# EAGLE design OGX360I-2CH (EAGLE 9.6.2)
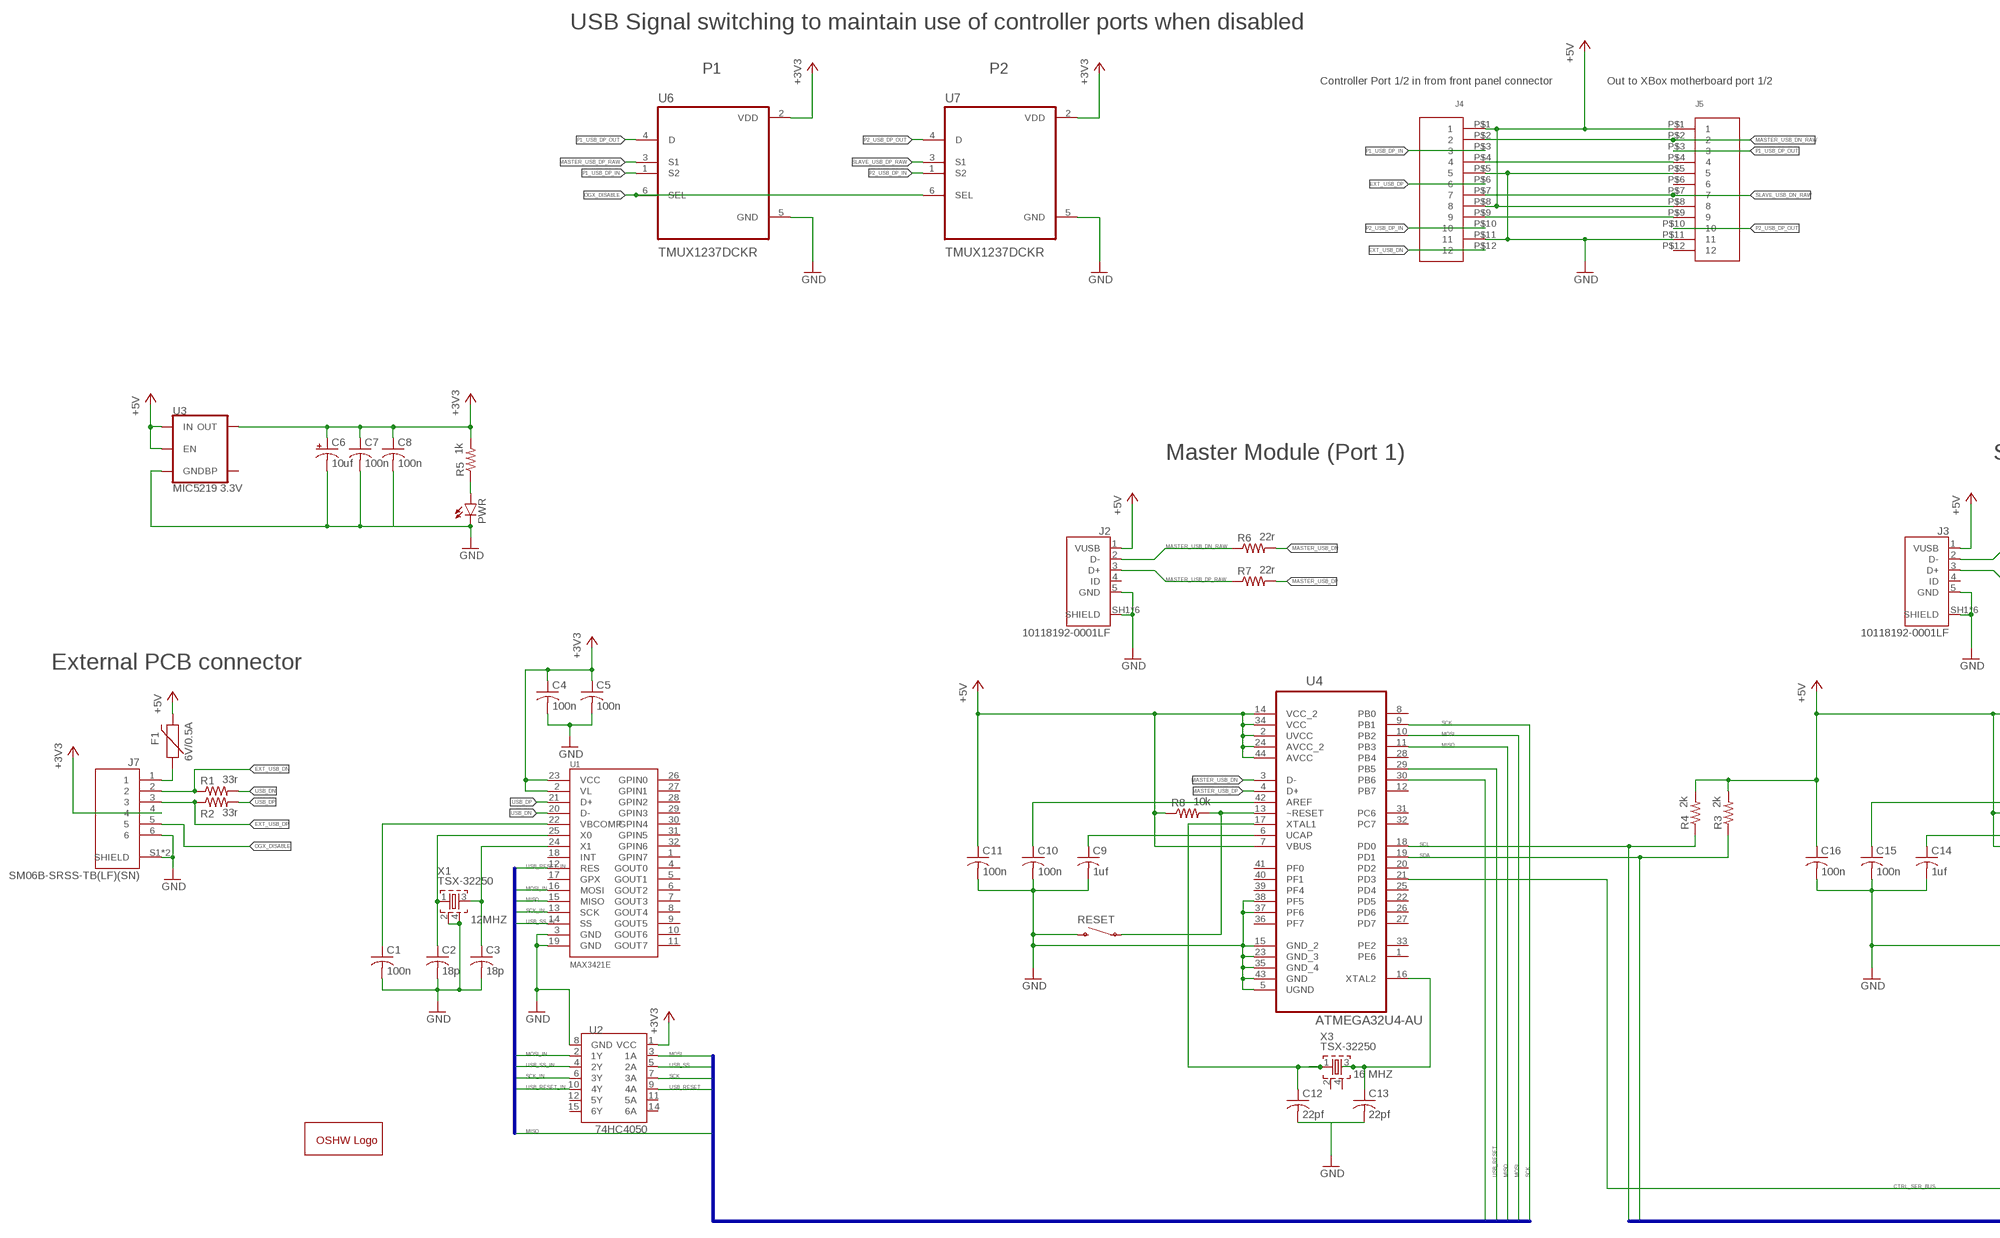
[diagram p0: schematic, sheet 1, part 1 of 2]
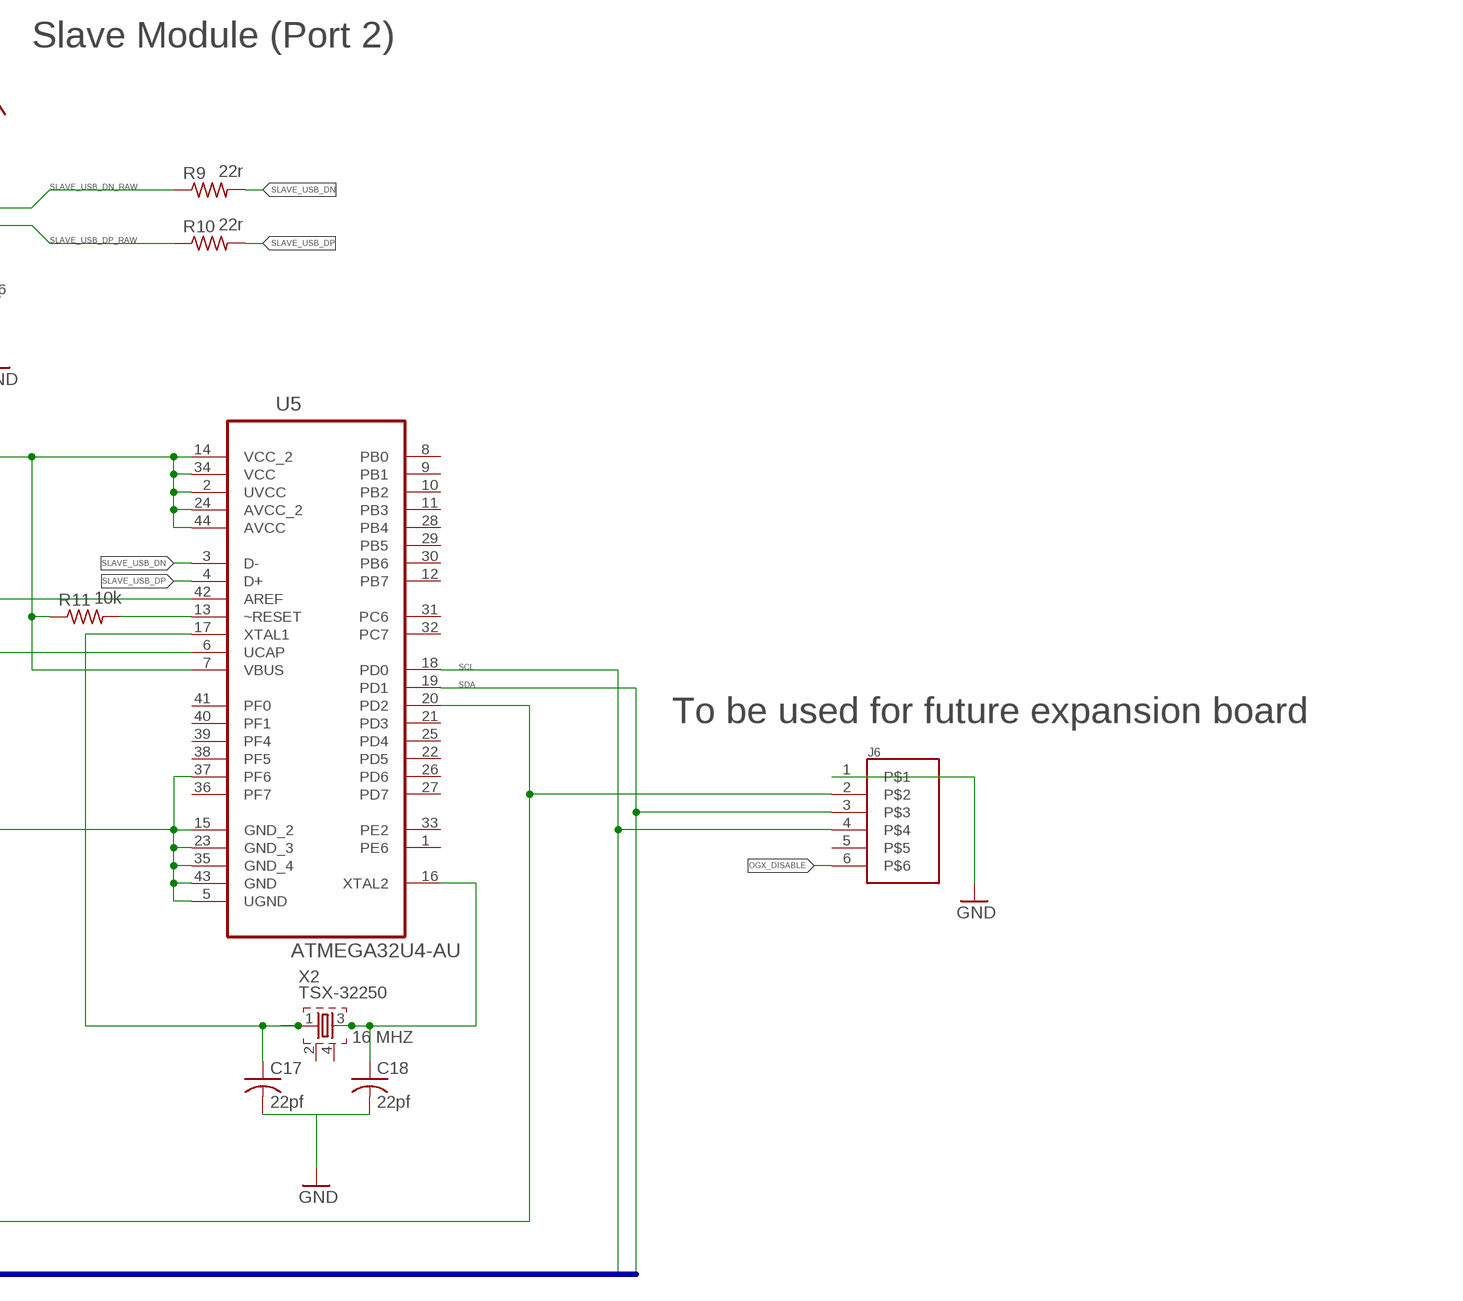
[diagram p1: schematic, sheet 1, part 2 of 2]

## Parts
C1  100n  C-USC0805  [C0805]
C2  18p  C-USC0805  [C0805]
C3  18p  C-USC0805  [C0805]
C4  100n  C-USC0805  [C0805]
C5  100n  C-USC0805  [C0805]
C6  10uf  CPOL-US153CLV-0405  [153CLV-0405]
C7  100n  C-USC0805  [C0805]
C8  100n  C-USC0805  [C0805]
C9  1uf  C-USC0805  [C0805]
C10  100n  C-USC0805  [C0805]
C11  100n  C-USC0805  [C0805]
C12  22pf  C-USC0805  [C0805]
C13  22pf  C-USC0805  [C0805]
C14  1uf  C-USC0805  [C0805]
C15  100n  C-USC0805  [C0805]
C16  100n  C-USC0805  [C0805]
C17  22pf  C-USC0805  [C0805]
C18  22pf  C-USC0805  [C0805]
F1  6V/0.5A  PPTC_HALF-AMP  [1206]
GOLD_ORB_SM1  OSHWLOGOLOGO8MM  [OSHW_8MM]
J2  10118192-0001LF  [AMPHENOL_10118192-0001LF]
J3  10118192-0001LF  [AMPHENOL_10118192-0001LF]
J4  B12B-PHDSS  [B12B-PHDSS]
J5  B12B-PHDSS  [B12B-PHDSS]
J6  B6B-PH-K-S  [B6B-PH-K]
J7  SM06B-SRSS-TB(LF)(SN)  [JST_SM06B-SRSS-TB(LF)(SN)]
PWR  LEDCHIP-LED0805  [CHIP-LED0805]
R1  33r  R-US_M0805  [M0805]
R2  33r  R-US_M0805  [M0805]
R3  2k  R-US_M0805  [M0805]
R4  2k  R-US_M0805  [M0805]
R5  1k  R-US_M0805  [M0805]
R6  22r  R-US_M0805  [M0805]
R7  22r  R-US_M0805  [M0805]
R8  10k  R-US_M0805  [M0805]
R9  22r  R-US_M0805  [M0805]
R10  22r  R-US_M0805  [M0805]
R11  10k  R-US_M0805  [M0805]
RESET  TL3305AF160QG  [TL3305AF160QG]
U1  MAX3421E  [TQFP32-5MM]
U2  74HC4050  HEX_CONVERTER  [SO16]
U3  MIC5219 3.3V  V_REG_MIC52193.3V  [SOT23-5]
U4  ATMEGA32U4-AU  [QFP80P1200X1200X120-44N]
U5  ATMEGA32U4-AU  [QFP80P1200X1200X120-44N]
U6  TMUX1237DCKR  [SOT65P210X110-6N]
U7  TMUX1237DCKR  [SOT65P210X110-6N]
X1  TSX-32250  [TSX-3225]
X2  TSX-32250  [TSX-3225]
X3  TSX-32250  [TSX-3225]

## Nets
+3V3: C4.1 C5.1 C6.+ C7.1 C8.1 J7.4 R5.2 U1.2(VL) U1.23(VCC) U2.1(VCC) U3.5(OUT) U6.2(VDD) U7.2(VDD)
+5V: C11.1 C16.1 F1.2 J2.1(VUSB) J3.1(VUSB) J4.P$1 J4.P$8 J5.P$1 J5.P$8 R3.2 R4.2 R8.1 R11.1 U3.1(IN) U3.3(EN) U4.2(UVCC) U4.7(VBUS) U4.14(VCC_2) U4.24(AVCC_2) U4.34(VCC) U4.44(AVCC) U5.2(UVCC) U5.7(VBUS) U5.14(VCC_2) U5.24(AVCC_2) U5.34(VCC) U5.44(AVCC)
CTRL_SER_BUS: J6.2 U4.21(PD3) U5.20(PD2)
EXT_USB_DN: J4.P$12 J7.2 R1.1
EXT_USB_DP: J4.P$6 J7.3 R2.1
GND: C1.2 C2.2 C3.2 C4.2 C5.2 C6.- C7.2 C8.2 C9.2 C10.2 C11.2 C12.2 C13.2 C14.2 C15.2 C16.2 C17.2 C18.2 J2.5(GND) J2.SH1(SHIELD) J2.SH2(SHIELD) J2.SH3(SHIELD) J2.SH4(SHIELD) J2.SH5(SHIELD) J2.SH6(SHIELD) J3.5(GND) J3.SH1(SHIELD) J3.SH2(SHIELD) J3.SH3(SHIELD) J3.SH4(SHIELD) J3.SH5(SHIELD) J3.SH6(SHIELD) J4.P$5 J4.P$11 J5.P$5 J5.P$11 J6.1 J7.6 J7.S1(SHIELD) J7.S2(SHIELD) PWR.C RESET.P$1 RESET.P$2 U1.3(GND) U1.19(GND) U2.8(GND) U3.2(GND) U4.5(UGND) U4.15(GND_2) U4.23(GND_3) U4.35(GND_4) U4.37(PF6) U4.38(PF5) U4.43(GND) U5.5(UGND) U5.15(GND_2) U5.23(GND_3) U5.35(GND_4) U5.37(PF6) U5.43(GND) U6.5(GND) U7.5(GND) X1.2 X1.4
MASTER_USB_DN: R6.2 U4.3(D-)
MASTER_USB_DN_RAW: J2.2(D-) J4.P$2 J5.P$2 R6.1
MASTER_USB_DP: R7.2 U4.4(D+)
MASTER_USB_DP_RAW: J2.3(D+) R7.1 U6.3(S1)
MISO: U1.15(MISO) U4.11(PB3)
MOSI: U2.3(1A) U4.10(PB2)
MOSI_IN: U1.16(MOSI) U2.2(1Y)
N$1: C13.1 U4.16(XTAL2) X3.3
N$2: C3.1 U1.24(X1) X1.3
N$3: F1.1 J7.1
N$4: PWR.A R5.1
N$5: C2.1 U1.25(X0) X1.1
N$6: C1.1 U1.22(VBCOMP)
N$10: C9.1 U4.6(UCAP)
N$11: C10.1 U4.42(AREF)
N$14: C12.1 U4.17(XTAL1) X3.1
N$15: C14.1 U5.6(UCAP)
N$16: C15.1 U5.42(AREF)
N$20: C18.1 U5.16(XTAL2) X2.3
N$21: C17.1 U5.17(XTAL1) X2.1
N$23: J4.P$4 J5.P$4
N$27: J4.P$9 J5.P$9
OGX_DISABLE: J6.6 J7.5 U6.6(SEL) U7.6(SEL)
P1_USB_DP_IN: J4.P$3 U6.1(S2)
P1_USB_DP_OUT: J5.P$3 U6.4(D)
P2_USB_DP_IN: J4.P$10 U7.1(S2)
P2_USB_DP_OUT: J5.P$10 U7.4(D)
RESET: R8.2 R11.2 RESET.P$3 RESET.P$4 U4.13(~RESET) U5.13(~RESET)
SCK: U2.7(3A) U4.9(PB1)
SCK_IN: U1.13(SCK) U2.6(3Y)
SCL: J6.4 R4.1 U4.18(PD0) U5.18(PD0)
SDA: J6.3 R3.1 U4.19(PD1) U5.19(PD1)
SLAVE_USB_DN: R9.2 U5.3(D-)
SLAVE_USB_DN_RAW: J3.2(D-) J4.P$7 J5.P$7 R9.1
SLAVE_USB_DP: R10.2 U5.4(D+)
SLAVE_USB_DP_RAW: J3.3(D+) R10.1 U7.3(S1)
USB_DN: R1.2 U1.20(D-)
USB_DP: R2.2 U1.21(D+)
USB_RESET: U2.9(4A) U4.29(PB5)
USB_RESET_IN: U1.12(RES) U2.10(4Y)
USB_SS: U2.5(2A) U4.30(PB6)
USB_SS_IN: U1.14(SS) U2.4(2Y)
Unconnected: J2.4(ID) J3.4(ID) J5.P$6 J5.P$12 J6.5 U1.1(GPIN7) U1.4(GOUT0) U1.5(GOUT1) U1.6(GOUT2) U1.7(GOUT3) U1.8(GOUT4) U1.9(GOUT5) U1.10(GOUT6) U1.11(GOUT7) U1.17(GPX) U1.18(INT) U1.26(GPIN0) U1.27(GPIN1) U1.28(GPIN2) U1.29(GPIN3) U1.30(GPIN4) U1.31(GPIN5) U1.32(GPIN6) U2.11(5A) U2.12(5Y) U2.14(6A) U2.15(6Y) U3.4(BP) U4.1(PE6) U4.8(PB0) U4.12(PB7) U4.20(PD2) U4.22(PD5) U4.25(PD4) U4.26(PD6) U4.27(PD7) U4.28(PB4) U4.31(PC6) U4.32(PC7) U4.33(PE2) U4.36(PF7) U4.39(PF4) U4.40(PF1) U4.41(PF0) U5.1(PE6) U5.8(PB0) U5.9(PB1) U5.10(PB2) U5.11(PB3) U5.12(PB7) U5.21(PD3) U5.22(PD5) U5.25(PD4) U5.26(PD6) U5.27(PD7) U5.28(PB4) U5.29(PB5) U5.30(PB6) U5.31(PC6) U5.32(PC7) U5.33(PE2) U5.36(PF7) U5.38(PF5) U5.39(PF4) U5.40(PF1) U5.41(PF0) X2.2 X2.4 X3.2 X3.4

## Buses
SPI_BUS_3.3V:MISO,MOSI_IN,SCK_IN,USB_RESET_IN,USB_SS_IN
SPI_BUS_5V:MISO,MOSI,SCK,USB_RESET,USB_SS
I2C:SCL,SDA

## Notes on the sheet
- USB Signal switching to maintain use of controller ports when disabled
- P1 | P2
- Controller Port 1/2 in from front panel connector | Out to XBox motherboard port 1/2
- Master Module (Port 1) | Slave Module (Port 2)
- External PCB connector
- To be used for future expansion board
- 12MHZ
- 16 MHZ | 16 MHZ

## Library data of the parts
C1-C5 C7-C18 = rcl:C-US: CAPACITOR, American symbol; SPICEPREFIX: C
C6 = rcl:CPOL-US: POLARIZED CAPACITOR, American symbol; SPICEPREFIX: C
F1 = SparkFun-Fuses:PPTC: Resettable Fuse PPTC Resettable Fuse. Really a sort of resistor with a polymeric positive temperature coefficient whose resistance increases dramatically with an increase in temperature. When heated by the power passing through the resistance rises causing the current to be limited, protecting the circuit. This is achieved by the transition of the polymer from a crystalline to an amorphous state where the conductive carbon separates breaking the conductive pathways found in the cool crystalline structure. When a PPTC cools back down it resumes conducting letting the circuit turn back on. SparkFun Products: SparkFun RedBoard - Programmed with Arduino <https://www.sparkfun.com/products/12757> Pro Micro - 5V/16MHz <https://www.sparkfun.com/products/12640> Arduino Pro 328 - 5V/16MHz <https://www.sparkfun.com/products/10915> MP3 Trigger <https://www.sparkfun.com/products/13720>; PROD_ID: RES-08585
GOLD_ORB_SM1 = oshw:OSHWLOGO: The OSHW logo for PCB layout
J2 J3 = 10118192-0001LF:10118192-0001LF: Single Port 5 Contact Horizontal Right Angle Shielded Micro B USB 2.0 Connector Check prices <https://snapeda.com/parts/10118192-0001LF/Amphenol%20ICC%20%28FCI%29/view-part/?ref=eda>; ARROW_ELECTRONICS-PURCHASE-URL: https://snapeda.com/shop?store=Arrow+Electronics&id=4793801; AVAILABILITY: Good; DESCRIPTION: USB - micro B USB 2.0 Receptacle Connector 5 Position Surface Mount, Right Angle; DIGIKEY-PURCHASE-URL: https://snapeda.com/shop?store=DigiKey&id=4793801; MF: Amphenol ICC (FCI); MOUSER-PURCHASE-URL: https://snapeda.com/shop?store=Mouser&id=4793801; MP: 10118192-0001LF; PACKAGE: None; PRICE: None
J4 J5 = B12B-PHDSS:B12B-PHDSS
J6 = B6B-PH-K-S:B6B-PH-K-S
J7 = SM06B-SRSS-TB_LF__SN_:SM06B-SRSS-TB(LF)(SN): SH Series 6 Position 1 mm Surface Mount Right Angle Side Entry Shrouded Header; DESCRIPTION: Connector Header Surface Mount, Right Angle 6 position 0.039 _1.00mm_; DIGI-KEY_PART_NUMBER: 455-1806-1-ND; DIGI-KEY_PURCHASE_URL: https://www.digikey.com/product-detail/en/jst-sales-america-inc/SM06B-SRSS-TB_LF__SN_/455-1806-1-ND/926877?utm_source=snapeda&utm_medium=aggregator&utm_campaign=symbol; MF: JST Sales; MP: SM06B-SRSS-TB_LF__SN_; PACKAGE: None
PWR = led:LED: LED OSRAM: - CHIPLED LG R971, LG N971, LY N971, LG Q971, LY Q971, LO R971, LY R971 LH N974, LH R974 LS Q976, LO Q976, LY Q976 LO Q996 - Hyper CHIPLED LW Q18S LB Q993, LB Q99A, LB R99A - SideLED LS A670, LO A670, LY A670, LG A670, LP A670 LB A673, LV A673, LT A673, LW A673 LH A674 LY A675 LS A676, LA A676, LO A676, LY A676, LW A676 LS A679, LY A679, LG A679 - Hyper Micro SIDELED® LS Y876, LA Y876, LO Y876, LY Y876 LT Y87S - SmartLED LW L88C, LW L88S LB L89C, LB L89S, LG L890 LS L89K, LO L89K, LY L89K LS L896, LA L896, LO L896, LY L896 - TOPLED LS T670, LO T670, LY T670, LG T670, LP T670 LSG T670, LSP T670, LSY T670, LOP T670, LYG T670 LG T671, LOG T671, LSG T671 LB T673, LV T673, LT T673, LW T673 LH T674 LS T676, LA T676, LO T676, LY T676, LB T676, LH T676, LSB T676, LW T676 LB T67C, LV T67C, LT T67C, LS T67K, LO T67K, LY T67K, LW E67C LS E67B, LA E67B, LO E67B, LY E67B, LB E67C, LV E67C, LT E67C LW T67C LS T679, LY T679, LG T679 LS T770, LO T770, LY T770, LG T770, LP T770 LB T773, LV T773, LT T773, LW T773 LH T774 LS E675, LA E675, LY E675, LS T675 LS T776, LA T776, LO T776, LY T776, LB T776 LHGB T686 LT T68C, LB T68C - Hyper Mini TOPLED® LB M676 - Mini TOPLED Santana® LG M470 LS M47K, LO M47K, LY M47K Source: http://www.osram.convergy.de LUXEON: - LUMILED® LXK2-PW12-R00, LXK2-PW12-S00, LXK2-PW14-U00, LXK2-PW14-V00 LXK2-PM12-R00, LXK2-PM12-S00, LXK2-PM14-U00 LXK2-PE12-Q00, LXK2-PE12-R00, LXK2-PE12-S00, LXK2-PE14-T00, LXK2-PE14-U00 LXK2-PB12-K00, LXK2-PB12-L00, LXK2-PB12-M00, LXK2-PB14-N00, LXK2-PB14-P00, LXK2-PB14-Q00 LXK2-PR12-L00, LXK2-PR12-M00, LXK2-PR14-Q00, LXK2-PR14-R00 LXK2-PD12-Q00, LXK2-PD12-R00, LXK2-PD12-S00 LXK2-PH12-R00, LXK2-PH12-S00 LXK2-PL12-P00, LXK2-PL12-Q00, LXK2-PL12-R00 Source: www.luxeon.com KINGBRIGHT: KA-3528ASYC Source: www.kingbright.com
R1-R11 = rcl:R-US_: RESISTOR, American symbol; SPICEPREFIX: R
RESET = TL3305AF160QG:TL3305AF160QG
U1 = MAX3421E:MAX3421E: USB Peripheral/Host Controller with SPI Interface.; AVAILABILITY: Unavailable; DESCRIPTION: USB Controller USB 2.0 SPI Interface 32-TQFN _5x5_; MF: Maxim Integrated; MP: MAX3421E; PACKAGE: TQFP-32 Maxim Integrated; PRICE: None
U2 = 74HC4050:HEX_CONVERTER: 74HC4050 Hex Buffer 74HC4050 Hex Buffer Level Shifter SMD SO016 SparkFun Products CAN-BUS Shield <https://www.sparkfun.com/products/13262> (DEV-13262) SparkFun MP3 Player Shield <https://www.sparkfun.com/products/12660> (DEV-12660) SparkFun microSD Shield <https://www.sparkfun.com/products/12761> (DEV-12761) SparkFun USB Host Shield <https://www.sparkfun.com/products/9947> (DEV-09947); PROD_ID: IC-09604
U3 = MIC5219-3.3YM5-TR:V_REG_MIC5219: V_REG MIC5219 Standard 3.3V and 5V 500mA LDO voltage regulator in SOT-23 layout. Micrel part MIC5219. BP (by-pass) pin is used to lower output noise with 470pF cap, may be left open.; PROD_ID: VREG-09872
U4 U5 = ATMEGA32U4-AU:ATMEGA32U4-AU: 8-bit Microcontroller with ISP Flash and USB Controller; AVAILABILITY: Unavailable; DESCRIPTION: AVR AVR® ATmega Microcontroller IC 8-Bit 16MHz 32KB _16K x 16_ FLASH 44-TQFP _10x10_; MF: Microchip; MP: ATMEGA32U4-AU; PACKAGE: TQFP-44 Microchip; PRICE: None
U6 U7 = TMUX1237DCKR:TMUX1237DCKR: None Check prices <https://pricing.snapeda.com/search/part/TMUX1237DCKR/?ref=eda>; AVAILABILITY: Warning; DESCRIPTION: 3-? low ron, 5-V, 2:1 (SPDT) general purpose switch with no overshoot when switching inputs 6-SC70 -40 to 125; MF: Texas Instruments; MP: TMUX1237DCKR; PACKAGE: SOT-SC70-6 Texas Instruments; PRICE: None; PURCHASE-URL: https://pricing.snapeda.com/search/part/TMUX1237DCKR/?ref=eda
X1-X3 = TSX-3225:TSX-3225: MHz RANGE CRYSTAL UNIT Source: Epson Toyocom; DESCRIPTION: 26MHz ±10ppm Crystal 9pF 40 Ohms 4-SMD, No Lead; DIGI-KEY_PART_NUMBER: SER4180CT-ND; DIGI-KEY_PURCHASE_URL: https://www.digikey.com/product-detail/en/epson/TSX-3225-24.0000MF15X-AC6/SER4180CT-ND/6558821?utm_source=snapeda&utm_medium=aggregator&utm_campaign=symbol; MF: EPSON; MP: TSX-3225; PACKAGE: SMD-4 Epson

## Board
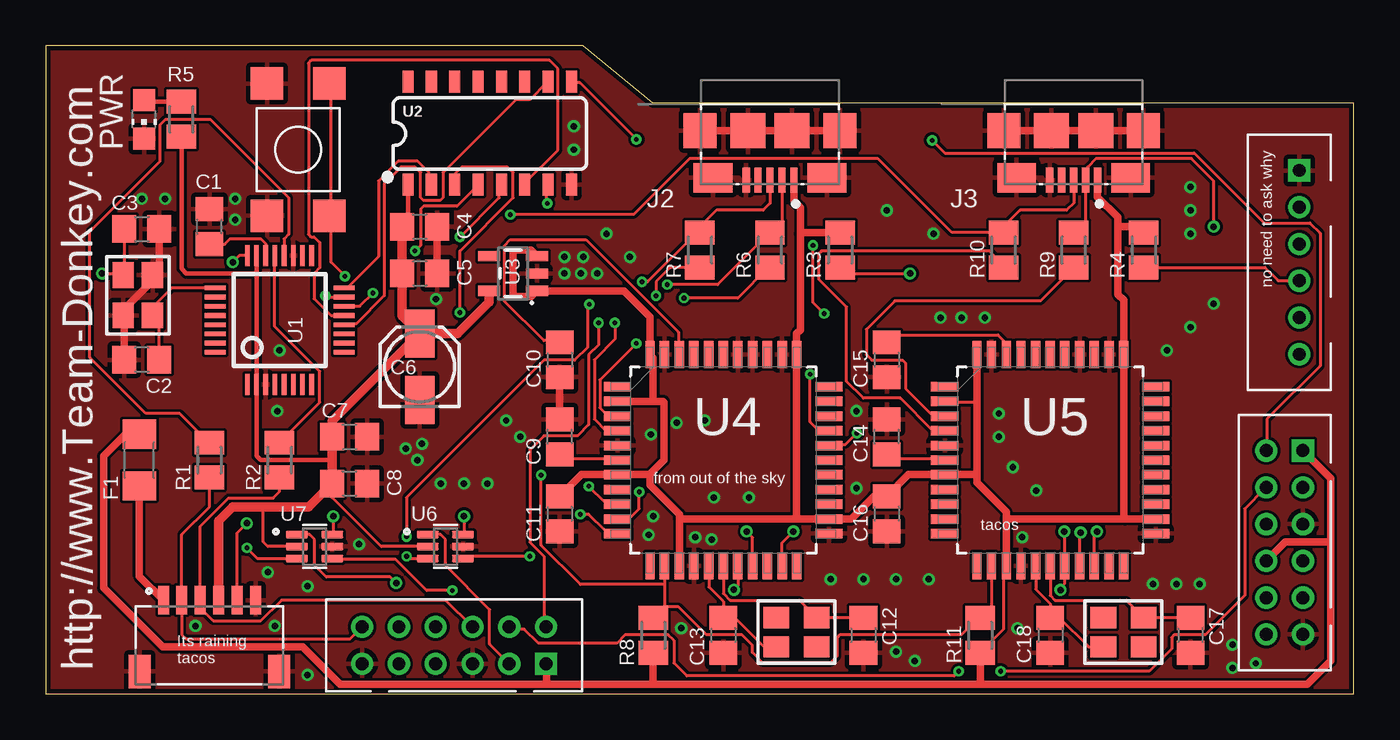
[diagram p2: board, top side]
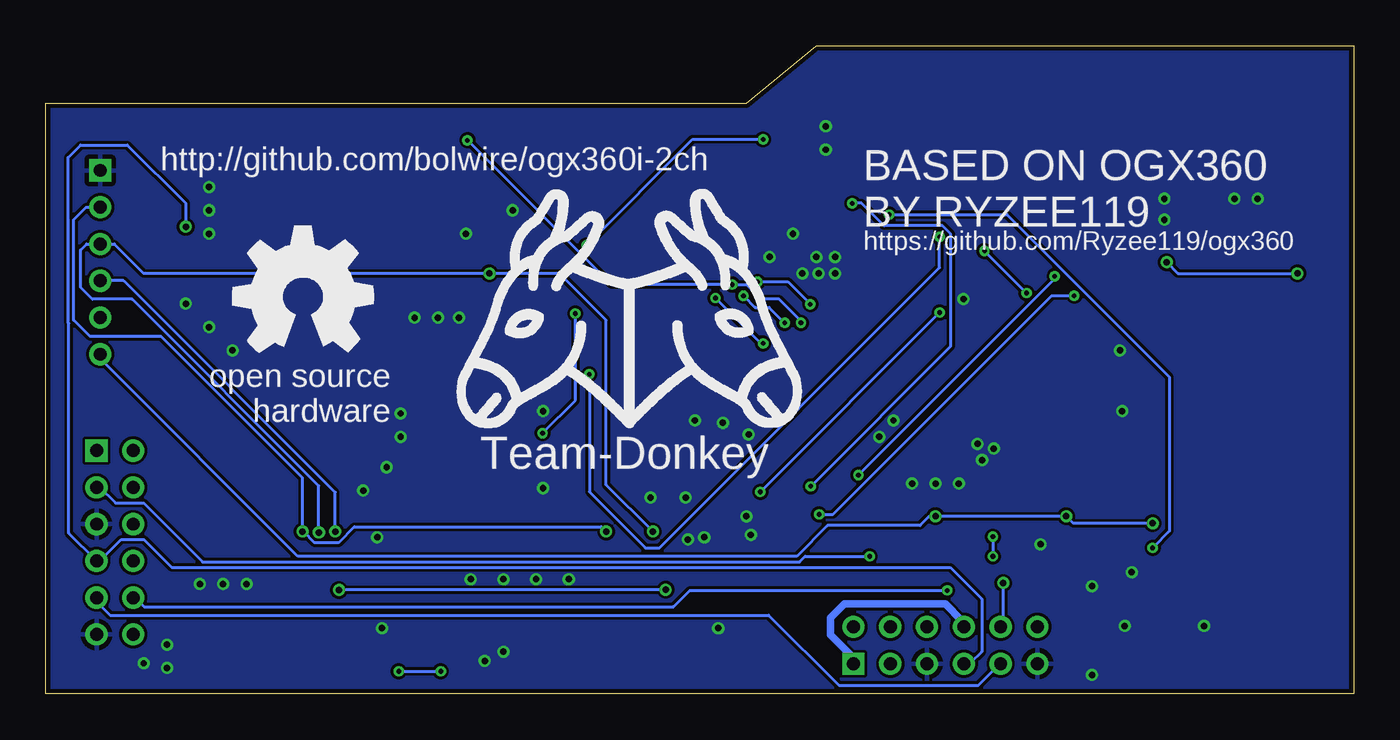
[diagram p3: board, bottom side, seen from below]

Size 71.1 x 35.23 mm. Coordinates in mm from the lower left corner, seen from the top.
Outline: 0,0 71.1,0 71.1,32.13 33.02,32.13 29.21,35.23 0,35.23 0,0
Copper layers (1*16): Top 0.035mm / dielectric 0.15mm / Bottom 0.035mm
Design rules "default *": minimum track width 6mil, minimum drill 10mil, track to track 6mil, track to pad 6mil, pad to pad 6mil, via to via 6mil, smd to smd 0mil, copper to edge 10mil, drill to drill 10mil, minimum pad ring 10mil, minimum via ring 6mil, stop-mask expansion 2mil, vias tented up to drill 100mil, thermal gap 10mil

### Footprints (pad centres in the part's own frame; a part is rotated, then mirrored left to right if it is on the bottom)
C0805 = smd 1.3 x 1.5: 1 -0.95,0; 2 0.95,0
153CLV-0405 = smd 2.6 x 1.6: + 1.8,0; - -1.8,0
1206 = smd 1.6 x 1.8: 1 -1.4,0; 2 1.4,0
AMPHENOL_10118192-0001LF = smd 0.4 x 1.35: 1 -1.3,0; 2 -0.65,0; 3 0,0; 4 0.65,0; 5 1.3,0 | smd 2.1 x 1.6: SH1 -3.1,-0.125; SH2 3.1,-0.125 | smd 1.8 x 1.9: SH3 -3.8,-2.675; SH6 3.8,-2.675 | smd 1.9 x 1.9: SH4 -1.2,-2.675; SH5 1.2,-2.675
B12B-PHDSS = drill 0.7 square: P$1 11.95,1.5 | drill 0.7: P$2 11.95,3.5; P$3 9.95,1.5; P$4 9.95,3.5; P$5 7.95,1.5; P$6 7.95,3.5; P$7 5.95,1.5; P$8 5.95,3.5; P$9 3.95,1.5; P$10 3.95,3.5; P$11 1.95,1.5; P$12 1.95,3.5
B6B-PH-K = drill 0.7 square: 1 11.95,1.7 | drill 0.7: 2 9.95,1.7; 3 7.95,1.7; 4 5.95,1.7; 5 3.95,1.7; 6 1.95,1.7
JST_SM06B-SRSS-TB(LF)(SN) = smd 0.6 x 1.55: 1 -2.5,0; 2 -1.5,0; 3 -0.5,0; 4 0.5,0; 5 1.5,0; 6 2.5,0 | smd 1.2 x 1.8: S1 -3.8,-3.875; S2 3.8,-3.875
CHIP-LED0805 = smd 1.2 x 1.2: A 0,-1.05; C 0,1.05
M0805 = smd 1.3 x 1.6: 1 -0.95,0; 2 0.95,0
TL3305AF160QG = smd 1.778 x 1.778: P$1 -3.6,-1.7; P$2 3.6,-1.7; P$3 -3.6,1.7 | smd 1.778 x 1.779: P$4 3.6,1.7
TQFP32-5MM = smd 1.143 x 0.254: 1 -3.5,1.75; 2 -3.5,1.25; 3 -3.5,0.75; 4 -3.5,0.25; 5 -3.5,-0.25; 6 -3.5,-0.75; 7 -3.5,-1.25; 8 -3.5,-1.75; 17 3.5,-1.75; 18 3.5,-1.25; 19 3.5,-0.75; 20 3.5,-0.25; 21 3.5,0.25; 22 3.5,0.75; 23 3.5,1.25; 24 3.5,1.75 | smd 0.254 x 1.143: 9 -1.75,-3.5; 10 -1.25,-3.5; 11 -0.75,-3.5; 12 -0.25,-3.5; 13 0.25,-3.5; 14 0.75,-3.5; 15 1.25,-3.5; 16 1.75,-3.5; 25 1.75,3.5; 26 1.25,3.5; 27 0.75,3.5; 28 0.25,3.5; 29 -0.25,3.5; 30 -0.75,3.5; 31 -1.25,3.5; 32 -1.75,3.5
SO16 = smd 0.6 x 1.2: 1 -4.445,-2.8; 2 -3.175,-2.8; 3 -1.905,-2.8; 4 -0.635,-2.8; 5 0.635,-2.8; 6 1.905,-2.8; 7 3.175,-2.8; 8 4.445,-2.8; 9 4.445,2.8; 10 3.175,2.8; 11 1.905,2.8; 12 0.635,2.8; 13 -0.635,2.8; 14 -1.905,2.8; 15 -3.175,2.8; 16 -4.445,2.8
SOT23-5 = smd 0.55 x 1.2: 1 -0.95,-1.3; 2 0,-1.3; 3 0.95,-1.3; 4 0.95,1.3; 5 -0.95,1.3
QFP80P1200X1200X120-44N = smd 1.473 x 0.508: 1 -5.74,3.988; 2 -5.74,3.2; 3 -5.74,2.388; 4 -5.74,1.6; 5 -5.74,0.787; 6 -5.74,0; 7 -5.74,-0.787; 8 -5.74,-1.6; 9 -5.74,-2.388; 10 -5.74,-3.2; 11 -5.74,-3.988; 23 5.74,-3.988; 24 5.74,-3.2; 25 5.74,-2.388; 26 5.74,-1.6; 27 5.74,-0.787; 28 5.74,0; 29 5.74,0.787; 30 5.74,1.6; 31 5.74,2.388; 32 5.74,3.2; 33 5.74,3.988 | smd 0.508 x 1.473: 12 -3.988,-5.74; 13 -3.2,-5.74; 14 -2.388,-5.74; 15 -1.6,-5.74; 16 -0.787,-5.74; 17 0,-5.74; 18 0.787,-5.74; 19 1.6,-5.74; 20 2.388,-5.74; 21 3.2,-5.74; 22 3.988,-5.74; 34 3.988,5.74; 35 3.2,5.74; 36 2.388,5.74; 37 1.6,5.74; 38 0.787,5.74; 39 0,5.74; 40 -0.787,5.74; 41 -1.6,5.74; 42 -2.388,5.74; 43 -3.2,5.74; 44 -3.988,5.74
SOT65P210X110-6N = smd 1.19 x 0.4: 1 -0.96,0.65; 2 -0.96,0; 3 -0.96,-0.65; 4 0.96,-0.65; 5 0.96,0; 6 0.96,0.65
TSX-3225 = smd 1.4 x 1.15: 1 0,-1.6; 2 2.2,-1.6; 3 2.2,0; 4 0,0

### Placement (x,y rotation side)
C1  8.89,25.4 90 top
C2  5.21,18.16 180 top
C3  5.21,25.27 0 top
C4  20.32,25.4 0 top
C5  20.32,22.86 0 top
C6  20.32,17.78 90 top
C7  16.51,13.97 0 top
C8  16.51,11.43 0 top
C9  27.94,13.97 90 top
C10  27.94,18.16 270 top
C11  27.94,9.78 270 top
C12  44.45,3.17 270 top
C13  36.83,3.17 270 top
C14  45.72,13.97 90 top
C15  45.72,18.16 270 top
C16  45.72,9.78 270 top
C17  62.23,3.17 270 top
C18  54.61,3.17 270 top
F1  5.08,12.7 90 top
GOLD_ORB_SM1  57.15,21.59 0 bottom
J2  39.37,27.94 180 top
J3  55.88,27.94 180 top
J4  15.24,0.13 0 top
J5  69.85,1.27 90 top
J6  69.85,16.51 90 top
J7  8.89,5.08 0 top
PWR  5.33,31.24 180 top
R1  8.89,12.7 90 top
R2  12.7,12.7 90 top
R3  43.18,24.13 90 top
R4  59.69,24.13 90 top
R5  7.37,31.24 270 top
R6  39.37,24.13 270 top
R7  35.56,24.13 270 top
R8  33.02,3.17 90 top
R9  55.88,24.13 270 top
R10  52.07,24.13 270 top
R11  50.8,3.17 90 top
RESET  13.72,29.59 270 top
U1  12.7,20.32 90 top
U2  24.13,30.48 0 top
U3  25.4,22.86 90 top
U4  36.83,12.7 0 top
U5  54.61,12.7 0 top
U6  21.72,8 0 top
U7  14.61,8 0 top
X1  4.19,20.57 90 top
X2  59.69,2.54 180 top
X3  41.91,2.54 180 top

### Tracks (layer width: path | path; a pad name or v marks a point on that pad's centre or on a via)
+3V3
  Top 0.152: U7.2 12.07,8 11.81,8.26 11.81,10.03 11.94,10.16 | U6.2 18.23,8 15.56,10.67 C8.1
  Top 0.254: U1.23 11.45,22.86 | 11.45,22.86 U1.2 11.45,12.93 11.68,12.7 15.56,12.7 | U2.1 19.68,25.71 C4.1 | R5.2 7.37,23.11 7.62,22.86 11.45,22.86
  Top 0.508: C4.1 C5.1 19.37,20.53 C6.+ | U3.5 24.1,21.31 22.37,19.58 C6.+ | C6.+ 15.56,14.82 C7.1 15.56,12.7 C8.1 14.29,10.16 11.94,10.16 10.16,10.16 9.39,9.39 J7.4
+5V
  Top 0.152: 27.23,1.52 J4.P$1 | 50.61,15.85 48.87,15.85 U5.2 | R11.1 50.8,2.24 52.07,3.5 52.07,6.86 U5.14
  Top 0.406: U3.3 26.38,24.13 25.4,24.13 25.4,21.59 26.38,21.59 U3.1 31.43,21.91 32.84,20.5 U4.44 33.02,18.26 33.02,15.9 | F1.2 4.32,14.1 3.14,12.92 3.14,5.75 6.35,2.54 13.97,2.54 16,0.51 27.23,0.51 | J5.P$1 69.85,11.72 69.85,8.26 | 27.23,0.51 33.02,0.51 | 33.02,0.51 50.8,0.51 | 50.8,0.51 68.58,0.51 69.85,1.78 69.85,8.26 | 50.8,0.51 R11.1 | R8.1 33.02,0.51 | 69.85,8.26 67.39,8.26 J5.P$8 | 34.44,9.53 34.44,9.75 32.84,11.35 32.84,11.94 | 34.44,9.53 U4.14 | 52.22,9.53 52.22,9.88 50.61,11.49 50.61,11.94 | 52.22,9.53 U5.14 | 40.77,9.5 U4.24 43.79,9.5 45.02,10.73 C16.1 46.9,11.91 U5.7 50.58,11.91 50.61,11.94 | 40.77,9.5 34.47,9.5 34.44,9.53 | U5.24 58.67,9.5 | 58.67,9.5 52.25,9.5 52.22,9.53 | 40.77,9.5 40.82,9.55 U4.34 40.82,19.58 41.02,19.79 41.02,25.02 | 58.67,9.5 58.6,9.58 U5.34 58.6,21.41 58.29,21.72 58.29,25.4 | 58.29,25.4 58.29,25.91 57.18,27.02 J3.1 | 58.29,25.4 59.37,25.4 | U5.44 50.61,18.43 50.61,15.85 50.61,11.94 | 32.84,11.94 32.82,11.91 U4.7 29.12,11.91 C11.1 | 32.84,11.94 33.6,12.7 33.6,15.85 33.55,15.9 33.02,15.9 | J2.1 40.67,26.8 41.02,26.45 41.02,25.02 | R3.2 41.08,25.08 41.02,25.02 | 27.23,0.51 27.23,1.52 | 33.02,15.9 U4.2
  Top 0.508: 59.37,25.4 R4.2
  Bottom 0.152: 21.29,3.66 J4.P$8 | 27.23,1.68 J4.P$1
  Bottom 0.406: 21.29,3.66 21.29,3.96 22.2,4.88 27.69,4.88 28.45,4.12 28.45,3.2 27.23,1.98 27.23,1.68
CTRL_SER_BUS  (via drill 0.35)
  Top 0.152: U5.20 57,8.66 v57.15,8.82 | U4.21 40.03,8.21 v40.64,8.82
  Bottom 0.152: J6.2 68.92,26.46 69.6,25.78 69.6,20.32 68.71,19.43 64.84,19.43 57.15,11.74 v57.15,8.82 57.1,8.82 56.49,8.21 55.2,8.21 54.33,9.07 40.89,9.07 v40.64,8.82
EXT_USB_DN
  Top 0.152: R1.1 8.89,10.16 7.39,8.66 J7.2 7.39,3.2 7.62,2.97 16.54,2.97 J4.P$12
EXT_USB_DP
  Top 0.152: R2.1 12.7,10.99 12.36,10.64 9.93,10.64 8.39,9.1 J7.3 8.48,5.03 8.48,4.57 9.09,3.96 11.68,3.96 12.8,5.08 21.74,5.08 J4.P$6
GND  (via drill 0.35)
  Top 0.406: J2.SH6 J2.SH5 J2.SH4 J2.SH3 | J3.SH6 J3.SH5 J3.SH4 J3.SH3 | C2.2 4.26,20.51 X1.4 4.19,20.88 5.79,22.48 X1.2 6.16,23.14 C3.2 | C5.2 C4.2 | C10.2 C9.2
  other vias: 8.13,3.68 12.45,3.68 14.22,1.02 17.02,8.13 20.19,12.7 19.56,13.34 20.45,13.59 21.46,11.43 22.73,11.43 24,11.43 25.02,14.86 25.78,13.97 33.02,9.65 32.77,8.64 35.31,8.51 36.2,8.38 34.54,3.56 46.23,2.29 47.24,1.78 53.09,8.51 52.83,3.56 64.52,1.4 64.52,2.67 65.79,1.65 60.2,5.97 61.47,5.97 62.74,5.97 53.85,11.05 52.58,12.32 51.82,13.97 51.82,15.24 44.07,11.18 44.07,15.37 35.81,14.86 34.29,14.73 36.32,10.67 38.23,10.67 32.89,14.1 28.19,23.75 28.19,22.86 29.08,22.86 29.97,22.86 29.21,23.75 28.7,30.86 28.7,29.59 30.48,25.02 31.75,23.75 45.72,26.29 48.26,25.02 62.23,27.56 62.23,26.29 62.23,25.02 42.67,6.22 44.45,6.22 46.23,6.22 48.01,6.22 10.29,26.92 10.29,25.78 6.48,26.92 5.21,26.92 12.7,18.67 12.57,15.37 21.21,21.46 12.07,6.6 14.22,5.84 63.5,21.21 62.23,19.94 60.96,18.67 48.64,20.45 49.78,20.45 51.05,20.45
  pour Bottom: -5.08,40.64 74.93,40.64 74.93,-10.16 -8.89,-10.16 -8.89,36.83
  pour Top: -5.08,38.1 -5.08,-3.81 -3.81,-5.08 72.39,-5.08 74.93,-2.54 74.93,34.29 71.12,38.1
MASTER_USB_DN  (via drill 0.25)
  Top 0.152: U4.3 30.58,15.09 30.12,15.54 30.12,17.07 v32.11,19.05 | v34.7,21.51 37.62,21.51 39.27,23.16 R6.2
  Bottom 0.152: v34.7,21.51 32.23,19.05 v32.11,19.05
MASTER_USB_DN_RAW  (via drill 0.25)
  Top 0.152: J2.2 40.02,25.73 R6.1 39.27,24.99 36.52,22.25 v33.78,22.25 | v30.05,20.17 30.05,18.97 29.52,18.44 29.52,14.63 28.9,14.02 27.08,14.02 26.31,13.26 26.31,8.23 27.08,7.47 27.08,3.66 J4.P$2 | v48.18,30.1 48.87,29.41 62.43,29.41 66.24,25.6 68.73,25.6 69.29,25.04 69.29,17.83 66.4,14.94 66.4,13.26 J5.P$2
  Bottom 0.152: v48.18,30.1 40.34,22.25 v33.78,22.25 33.02,22.25 32.24,21.48 31.25,21.48 30.05,20.27 v30.05,20.17
MASTER_USB_DP  (via drill 0.25)
  Top 0.152: v30.94,20.17 30.94,19.28 29.82,18.16 29.82,14.94 30.43,14.33 31.04,14.33 U4.4 | v33.17,21.64 33.17,22.4 33.93,23.16 35.46,23.16 R7.2
  Bottom 0.152: v33.17,21.64 32.54,21.01 31.77,21.01 v30.94,20.17
MASTER_USB_DP_RAW  (via drill 0.25)
  Top 0.152: J2.3 39.37,26.67 38.99,26.29 36.45,26.29 35.56,25.4 R7.1 35.46,25.15 32.72,22.4 v32.41,22.4 | v19.61,8.53 19.61,10.67 27.08,18.14 28.75,18.14 29.44,18.82 29.44,21.08 v29.54,21.18 | U6.3 19.65,7.35 19.61,7.41 v19.61,7.47
  Bottom 0.152: v19.61,8.53 v19.61,7.47 | v32.41,22.4 30.76,22.4 v29.54,21.18
MISO  (via drill 0.25)
  Top 0.152: v29.06,9.75 29.52,9.75 30.43,8.84 31.04,8.84 U4.11 | v15.19,21.64 15.26,21.57 U1.15
  Bottom 0.152: v15.19,21.64 16.41,21.64 28.3,9.75 v29.06,9.75
MOSI  (via drill 0.25)
  Top 0.152: U2.3 22.22,28.27 22.61,28.65 25.09,28.65 25.4,28.35 25.4,26.98 22.5,24.08 v22.5,20.73 | v32.26,10.97 32.26,10.06 31.8,9.6 31.19,9.6 U4.10
  Bottom 0.152: v32.26,10.97 v22.5,20.73
MOSI_IN
  Top 0.152: U1.16 16.26,22.1 16.41,22.1 18.09,23.77 18.09,27.89 19.15,28.96 20.22,28.96 20.83,28.35 20.83,27.74 U2.2
N$1
  Top 0.152: U4.16 36.04,5.8 36.83,5.01 C13.1 37.46,4.12 39.05,2.54 X3.3
N$2  (via drill 0.35)
  Top 0.152: C3.1 4.26,22.84 X1.3 4.11,22.86 v3.05,22.86 | U1.24 10.51,23.82 v10.16,23.47
  Bottom 0.152: v10.16,23.47 9.55,22.86 v3.05,22.86
N$3
  Top 0.406: J7.1 5.08,6.39 F1.1
N$4
  Top 0.254: PWR.A 5.43,32.19 R5.1
N$5
  Top 0.152: C2.1 6.16,20.21 X1.1 5.79,21.03 6.83,22.07 U1.25
N$6
  Top 0.152: C1.1 9.72,24.45 10.01,24.75 11.68,24.75 11.95,24.48 U1.22
N$10
  Top 0.152: U4.6 31.04,12.8 28.14,12.8 27.99,12.95 C9.1
N$11
  Top 0.152: U4.42 34.39,18.44 34.39,19.66 29.36,24.69 25.25,24.69 24.94,24.38 24.94,21.34 27.08,19.2 27.84,19.2 C10.1
N$14
  Top 0.152: C12.1 44.44,4.14 X3.1 40.97,5.08 37.2,5.08 36.83,5.45 U4.17
N$15
  Top 0.152: U5.6 48.87,12.8 45.97,12.8 45.82,12.95 C14.1
N$16
  Top 0.152: U5.42 52.22,19.05 51.77,19.51 46.13,19.51 45.82,19.2 C15.1
N$20
  Top 0.152: X2.3 56.7,2.54 55.12,4.12 C18.1 54.61,4.89 53.82,5.67 U5.16
N$21
  Top 0.152: C17.1 62.21,4.14 X2.1 58.75,5.08 58.42,5.08 54.86,5.08 54.61,5.33 U5.17
N$23  (via drill 0.25)
  Top 0.152: v51.92,1.22 59.99,1.22 61.21,2.44 61.21,3.05 61.37,3.2 63.04,3.2 65.18,5.33 65.18,10.06 66.24,11.12 J5.P$4 | J4.P$4 25.25,3.5 26.01,3.5 26.77,2.74 31.04,2.74 31.5,3.2 33.83,3.2 34.14,2.9 34.14,1.68 34.85,0.96 49.38,0.96 v49.63,1.22
  Bottom 0.152: v51.92,1.22 v49.63,1.22
N$27
  Bottom 0.152: J4.P$9 19.23,1.63 20.4,0.46 27.99,0.46 31.8,4.27 67.62,4.27 68.35,5 J5.P$9
OGX_DISABLE  (via drill 0.35)
  Top 0.152: J7.5 10.39,8.74 v10.92,9.27 | v15.62,9.65 15.62,8.71 U7.6 | v22.73,9.65 22.73,8.71 U6.6
  Bottom 0.152: v10.92,9.27 15.24,9.27 v15.62,9.65 v22.73,9.65 22.81,9.6 23.11,9.6 23.57,9.14 28.6,9.14 30.28,7.47 57.4,7.47 68.07,18.14 68.07,18.44 J6.6
P1_USB_DP_IN
  Top 0.152: J4.P$3 24.13,2.69 24.13,4.57 21.72,6.99 21.72,8.38 21.45,8.65 U6.1
P1_USB_DP_OUT  (via drill 0.25)
  Top 0.152: v26.31,7.47 22.81,7.47 U6.4
  Bottom 0.152: v26.31,7.47 29.82,7.47 30.12,7.16 62.59,7.16 65.79,10.36 67.31,10.36 68.22,11.28 J5.P$3
P2_USB_DP_IN  (via drill 0.35)
  Top 0.152: U7.1 14.34,8.65 14.61,8.38 14.61,6.99 15.24,6.35 18.72,6.35 v19.05,6.02
  Bottom 0.152: J4.P$10 19.05,3.77 v19.05,6.02
P2_USB_DP_OUT  (via drill 0.25)
  Top 0.152: v22.1,5.61 20.7,5.61 19,7.32 15.65,7.32 U7.4
  Bottom 0.152: v22.1,5.61 36.09,5.61 36.98,4.72 65.76,4.72 66.26,5.22 J5.P$10
RESET  (via drill 0.25)
  Top 0.152: U4.13 33.63,5.94 | 33.63,5.94 33.63,4.74 R8.2 33.63,4.72 34.39,4.72 35.92,3.2 37.85,3.2 38.41,2.64 38.41,2.23 38.96,1.68 42.65,1.68 43,2.03 43,3.02 43.18,3.2 49.78,3.2 50.7,4.12 R11.2 51.41,4.74 U5.13 | RESET.P$3 15.49,33.07 15.49,26.06 RESET.P$4 15.49,25.91 15.49,23.47 v16.26,22.71 | v26.92,11.89 26.92,8.08 29.06,5.94 33.63,5.94
  Bottom 0.152: v26.92,11.89 16.26,22.55 v16.26,22.71
SCK  (via drill 0.25)
  Top 0.152: v27.25,26.67 27.23,26.7 27.23,27.58 U2.7 | v29.52,11.28 30.43,10.36 31.04,10.36 U4.9
  Bottom 0.152: v27.25,26.67 26.75,26.67 25.53,25.45 22.35,25.45 21.89,24.99 21.89,18.9 v29.52,11.28
SCK_IN
  Top 0.152: U1.13 16.1,20.57 15.49,20.57 14.58,21.49 14.58,22.86 14.88,23.16 14.88,24.54 14.58,24.84 14.43,24.84 14.27,24.99 14.27,34.29 14.43,34.44 27.38,34.44 27.84,33.98 27.84,29.57 26.01,27.74 U2.6
SCL  (via drill 0.35)
  Top 0.152: v55.37,8.82 55.4,8.79 U5.18 55.4,5.99 55.17,5.76 v55.17,5.64 | J6.4 67.01,22.46 66.29,23.18 R4.1 | U4.18 37.62,5.87 v37.41,5.66
  Bottom 0.152: v55.37,8.82 55.37,10.95 66.88,22.46 J6.4 | v37.41,5.66 55.15,5.66 v55.17,5.64
SDA  (via drill 0.35)
  Top 0.152: R3.1 43.5,22.86 v46.99,22.86 | U4.19 38.43,8.49 v38.1,8.82 | U5.19 56.21,8.71 v56.26,8.76
  Bottom 0.152: v38.1,8.82 40.64,11.36 40.64,20.32 43.18,22.86 v46.99,22.86 65.79,22.86 67.39,24.46 J6.3 68.89,24.46 69.22,24.13 69.22,22.1 68.58,21.46 66.42,21.46 56.26,11.3 v56.26,8.76
SLAVE_USB_DN
  Top 0.152: U5.3 48.26,15.09 46.74,16.61 46.74,17.98 46.58,18.14 44.91,18.14 44.6,18.44 44.6,19.81 46.15,21.36 54.08,21.36 55.88,23.16 R9.2
SLAVE_USB_DN_RAW  (via drill 0.35)
  Top 0.152: R9.1 56.53,25.73 J3.2 56.64,28.04 56.64,28.65 57.1,29.11 62.28,29.11 63.5,27.89 v63.5,25.4
  Bottom 0.152: J4.P$7 21.13,1.68 20.83,1.68 20.22,2.29 20.22,5.16 21.92,6.86 64.26,6.86 65.79,8.38 67.01,8.38 68.22,7.16 J5.P$7 69.85,8.72 69.85,20.14 69.9,20.19 69.9,29.16 69.22,29.84 66.68,29.84 63.5,26.67 v63.5,25.4
SLAVE_USB_DP
  Top 0.152: U5.4 48.23,14.3 46.46,16.08 44.45,16.08 43.54,16.99 43.54,21.03 42.01,22.55 42.01,23.93 42.16,24.08 51.31,24.08 52.07,23.32 R10.2
SLAVE_USB_DP_RAW  (via drill 0.25)
  Top 0.152: J3.3 55.88,26.67 55.5,26.29 52.96,26.29 52.07,25.4 R10.1 49.27,25.08 45.24,29.11 35,29.11 31.95,26.06 v25.25,26.06 | v10.92,7.92 11.5,7.35 U7.3
  Bottom 0.152: v10.92,7.92 10.01,8.84 10.01,17.22 18.85,26.06 v25.25,26.06
USB_DN
  Top 0.152: U1.20 12.95,24.73 13.21,24.99 13.21,26.98 8.94,31.24 6.5,31.24 6.2,30.94 6.2,28.96 2.39,25.15 2.39,18.29 5.44,15.24 7.26,15.24 8.79,13.72 R1.2
USB_DP
  Top 0.152: U1.21 12.45,23.77 12.45,19.96 14.88,17.53 14.88,15.85 12.75,13.72 R2.2
USB_RESET  (via drill 0.25)
  Top 0.152: v32.11,30.15 29.03,33.22 28.6,33.22 U2.9 | v41.71,24.38 41.71,21.29 v42.32,20.68 | v44.09,14.17 43.48,13.56 42.62,13.56 U4.29
  Bottom 0.152: v32.11,30.15 35.94,30.15 v41.71,24.38 | v42.32,20.68 42.32,15.95 v44.09,14.17
USB_RESET_IN
  Top 0.152: U1.12 16.26,20.12 16.87,20.12 18.39,21.64 18.39,27.74 19.3,28.65 20.07,28.65 20.37,28.35 20.37,26.98 20.52,26.82 21.44,26.82 21.59,26.98 21.59,28.35 25.55,32.31 26.31,32.31 27.23,33.22 U2.10
USB_SS  (via drill 0.25)
  Top 0.152: v22.5,24.84 24.64,26.98 24.64,27.58 U2.5 | v41.55,17.37 41.55,14.78 42.01,14.33 42.47,14.33 U4.30
  Bottom 0.152: v22.5,24.84 22.5,23.16 37.74,7.92 38.51,7.92 41.55,10.97 v41.55,17.37
USB_SS_IN  (via drill 0.25)
  Top 0.152: v17.78,21.79 17.06,21.07 U1.14 | v20.07,24.08 20.37,24.38 20.37,26.36 20.52,26.52 22.35,26.52 23.42,27.58 U2.4
  Bottom 0.152: v20.07,24.08 v17.78,21.79

### Text on the board
tPlace: no need to ask why | from out of the sky | tacos | Its raining / tacos | http://www.Team-Donkey.com
bPlace: http://github.com/bolwire/ogx360i-2ch | BASED ON OGX360 / BY RYZEE119 | https://github.com/Ryzee119/ogx360 | Team-Donkey
bStop: OGX360I-2CH